# EAGLE schematic Schaltplan (EAGLE 6.5.0)
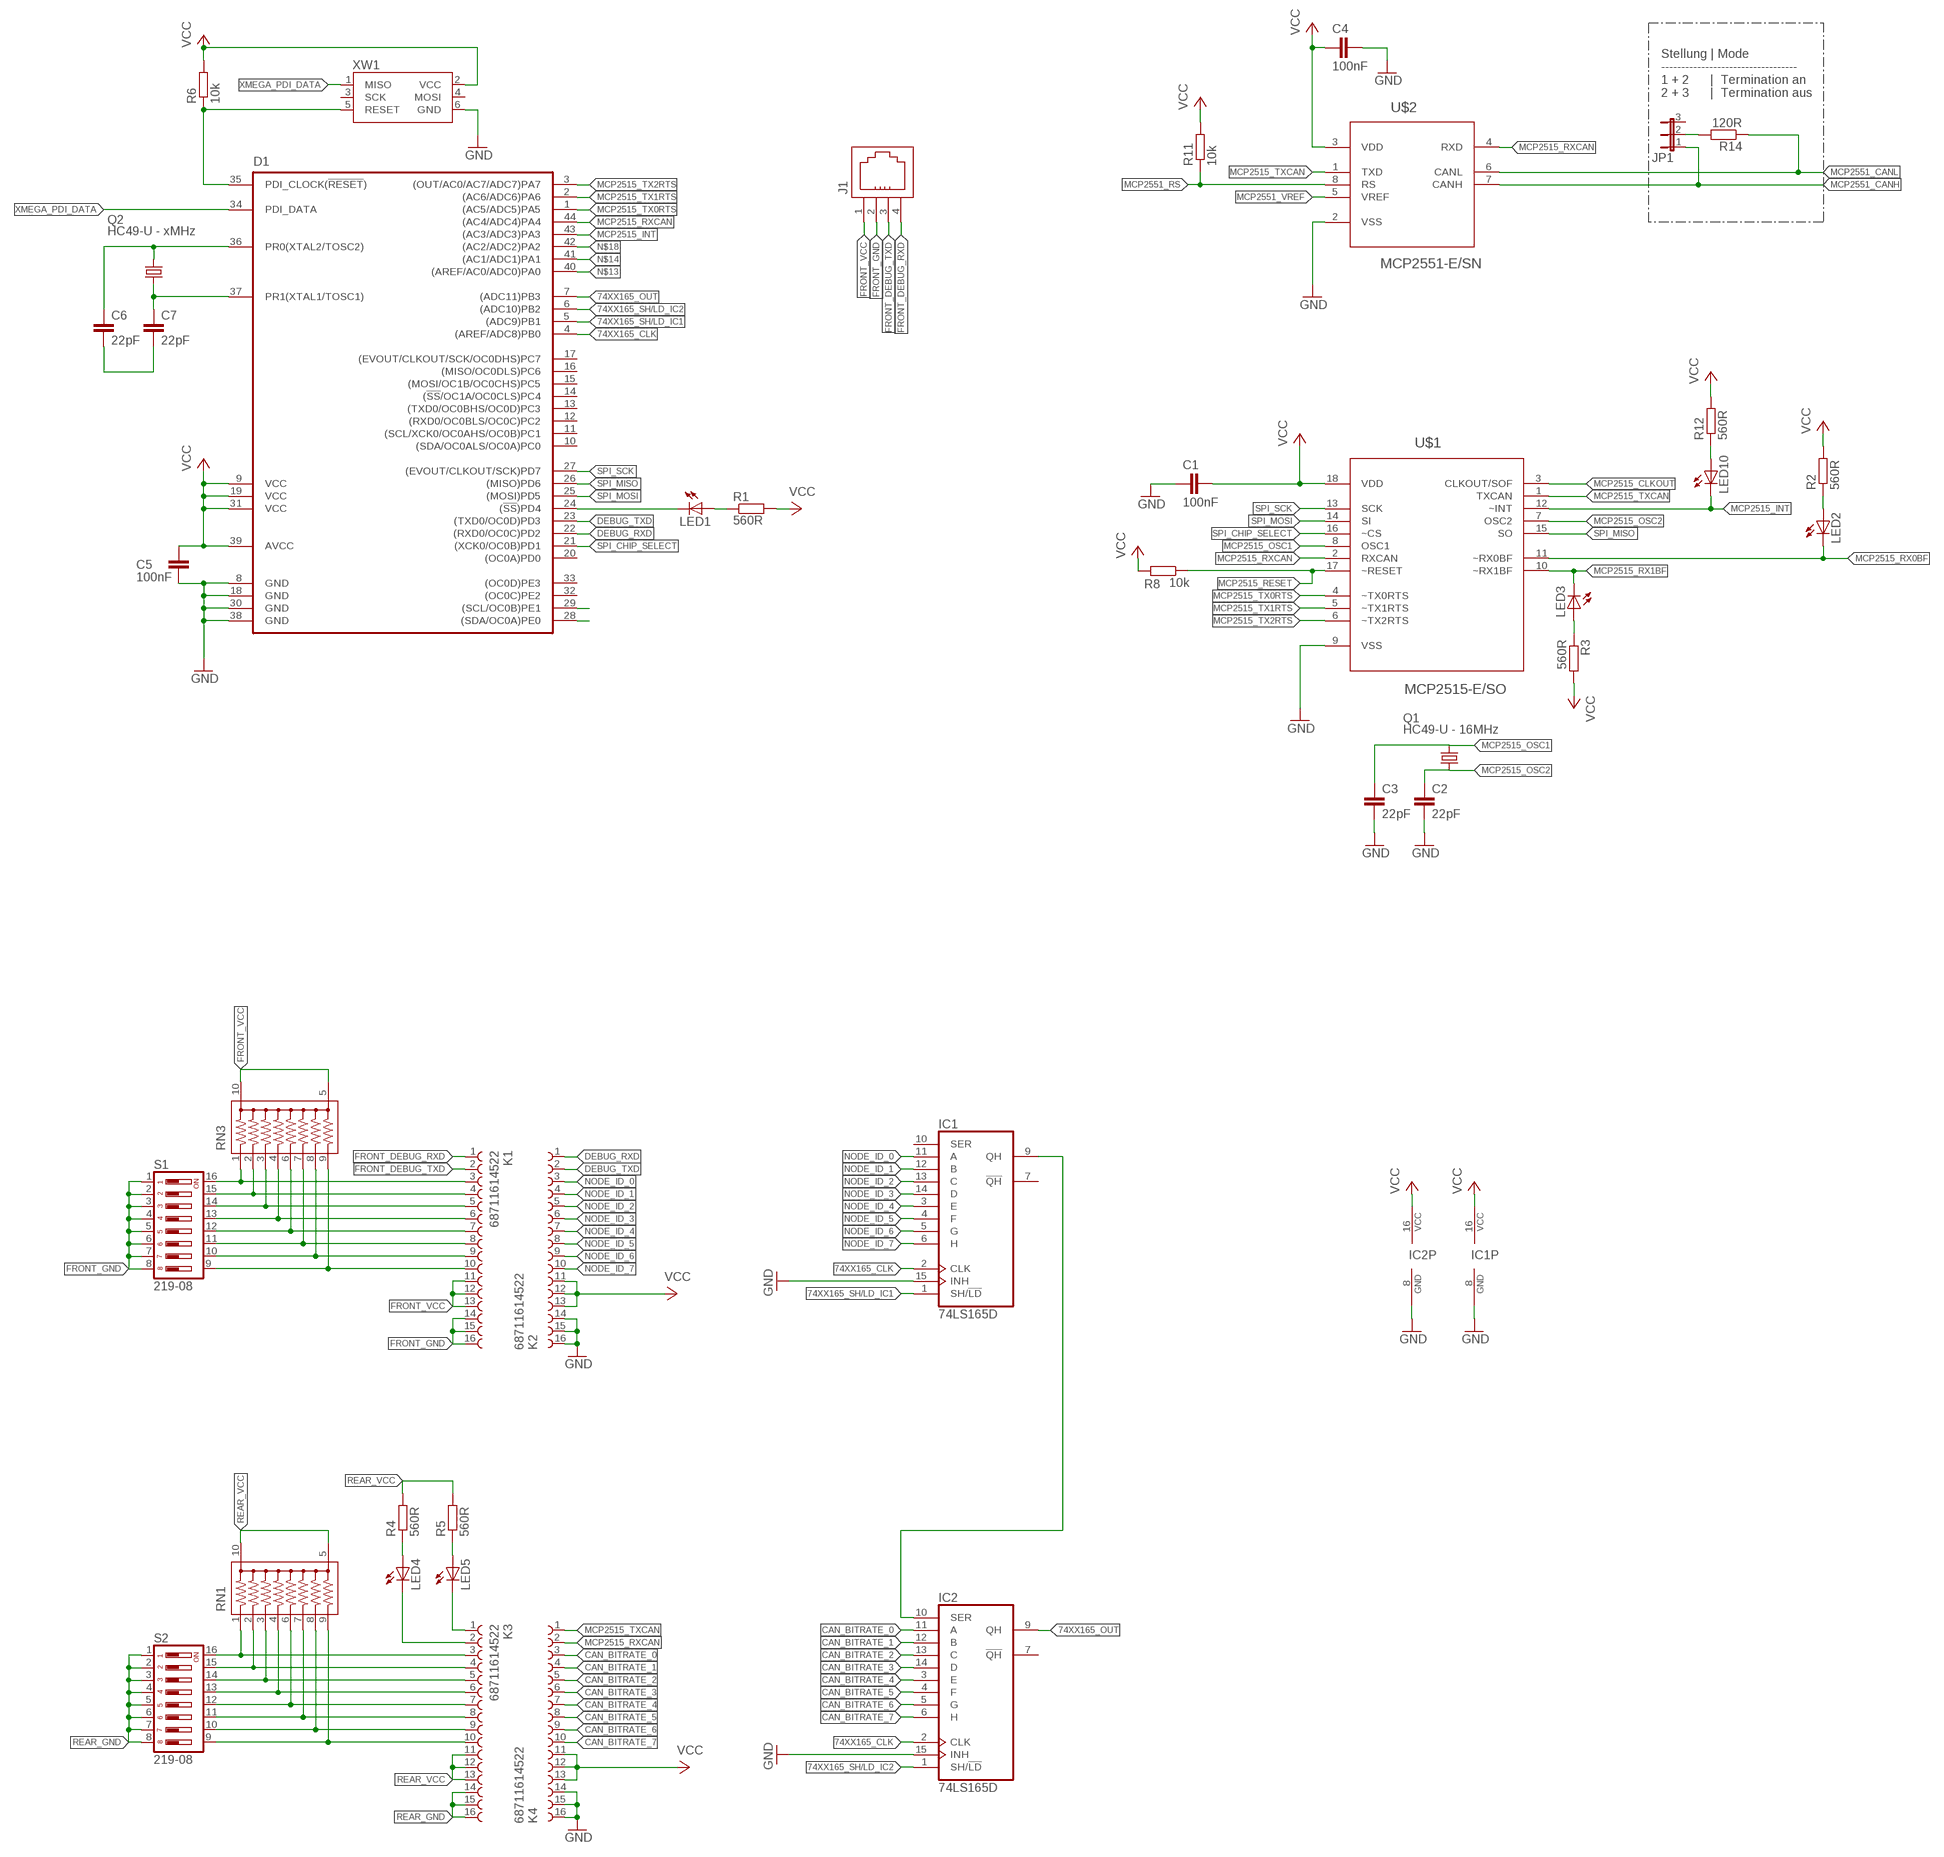
[diagram p0: schematic, sheet 1]

## Parts
C1  100nF  C-EUC1206  [C1206]
C2  22pF  C-EUC1206  [C1206]
C3  22pF  C-EUC1206  [C1206]
C4  100nF  C-EUC1206  [C1206]
C5  100nF  C-EUC1206  [C1206]
C6  22pF  C-EUC1206  [C1206]
C7  22pF  C-EUC1206  [C1206]
D1  ATXMEGA16D4/32D4/64D4/128D4-A  [TQFP44A]
IC1  74LS165D  [SO16]
IC2  74LS165D  [SO16]
J1  615004143821  [615004143821]
JP1  JP2E  [JP2]
K1  68711614522  [68711614522]
K2  68711614522  [68711614522]
K3  68711614522  [68711614522]
K4  68711614522  [68711614522]
LED1  LEDSML1206  [SML1206]
LED2  LEDSML1206  [SML1206]
LED3  LEDSML1206  [SML1206]
LED4  LEDSML1206  [SML1206]
LED5  LEDSML1206  [SML1206]
LED10  LEDSML1206  [SML1206]
Q1  HC49-U - 16MHz  HC49-U  [HC49]
Q2  HC49-U - xMHz  HC49-U  [HC49]
R1  560R  R-EU_R1206  [R1206]
R2  560R  R-EU_R1206  [R1206]
R3  560R  R-EU_R1206  [R1206]
R4  560R  R-EU_R1206  [R1206]
R5  560R  R-EU_R1206  [R1206]
R6  10k  R-EU_R1206  [R1206]
R8  10k  R-EU_R1206  [R1206]
R11  10k  R-EU_R1206  [R1206]
R12  560R  R-EU_R1206  [R1206]
R14  120R  R-EU_R1206  [R1206]
RN1  745-10  [745-10]
RN3  745-10  [745-10]
S1  219-08  [CTS-219-08]
S2  219-08  [CTS-219-08]
U$1  MCP2515-E/SO  [SOIC127P1030X265-18N]
U$2  MCP2551-E/SN  [SOIC127P600X175-8N]
XW1  WSL6  [WSL]

## Nets
74XX165_CLK: D1.4((AREF/ADC8)PB0) IC1.2(CLK) IC2.2(CLK)
74XX165_OUT: D1.7((ADC11)PB3) IC2.9(QH)
74XX165_SH/LD_IC1: D1.5((ADC9)PB1) IC1.1(SH/!LD)
74XX165_SH/LD_IC2: D1.6((ADC10)PB2) IC2.1(SH/!LD)
CAN_BITRATE_0: IC2.11(A) K4.3
CAN_BITRATE_1: IC2.12(B) K4.4
CAN_BITRATE_2: IC2.13(C) K4.5
CAN_BITRATE_3: IC2.14(D) K4.6
CAN_BITRATE_4: IC2.3(E) K4.7
CAN_BITRATE_5: IC2.4(F) K4.8
CAN_BITRATE_6: IC2.5(G) K4.9
CAN_BITRATE_7: IC2.6(H) K4.10
DEBUG_RXD: D1.22((RXD0/OC0C)PD2) K2.1
DEBUG_TXD: D1.23((TXD0/OC0D)PD3) K2.2
FRONT_DEBUG_RXD: J1.4 K1.1
FRONT_DEBUG_TXD: J1.3 K1.2
FRONT_GND: J1.2 K1.14 K1.15 K1.16 S1.1 S1.2 S1.3 S1.4 S1.5 S1.6 S1.7 S1.8
FRONT_VCC: J1.1 K1.11 K1.12 K1.13 RN3.5 RN3.10
GND: C1.2 C2.2 C3.2 C4.1 C5.2 D1.8(GND) D1.18(GND) D1.30(GND) D1.38(GND) IC1.8(GND) IC1.15(INH) IC2.8(GND) IC2.15(INH) K2.14 K2.15 K2.16 K4.14 K4.15 K4.16 U$1.9(VSS) U$2.2(VSS) XW1.6(GND)
MCP2515_CLKOUT: U$1.3(CLKOUT/SOF)
MCP2515_INT: D1.43((AC3/ADC3)PA3) LED10.C U$1.12(~INT)
MCP2515_OSC1: C3.1 Q1.2 U$1.8(OSC1)
MCP2515_OSC2: C2.1 Q1.1 U$1.7(OSC2)
MCP2515_RESET: R8.1 U$1.17(~RESET)
MCP2515_RX0BF: LED2.C U$1.11(~RX0BF)
MCP2515_RX1BF: LED3.C U$1.10(~RX1BF)
MCP2515_RXCAN: D1.44((AC4/ADC4)PA4) K4.2 U$1.2(RXCAN) U$2.4(RXD)
MCP2515_TX0RTS: D1.1((AC5/ADC5)PA5) U$1.4(~TX0RTS)
MCP2515_TX1RTS: D1.2((AC6/ADC6)PA6) U$1.5(~TX1RTS)
MCP2515_TX2RTS: D1.3((OUT/AC0/AC7/ADC7)PA7) U$1.6(~TX2RTS)
MCP2515_TXCAN: K4.1 U$1.1(TXCAN) U$2.1(TXD)
MCP2551_CANH: JP1.1 U$2.7(CANH)
MCP2551_CANL: R14.1 U$2.6(CANL)
MCP2551_RS: R11.1 U$2.8(RS)
MCP2551_VREF: U$2.5(VREF)
N$1: LED2.A R2.1
N$2: IC1.9(QH) IC2.10(SER)
N$3: LED3.A R3.1
N$4: K3.3 RN1.1 S2.16
N$5: K3.4 RN1.2 S2.15
N$6: K3.5 RN1.3 S2.14
N$7: K3.6 RN1.4 S2.13
N$8: K3.7 RN1.6 S2.12
N$9: K3.8 RN1.7 S2.11
N$11: LED10.A R12.1
N$12: JP1.2 R14.2
N$13: D1.40((AREF/AC0/ADC0)PA0)
N$14: D1.41((AC1/ADC1)PA1)
N$15: C6.1 D1.36(PR0(XTAL2/TOSC2)) Q2.2
N$16: C7.1 D1.37(PR1(XTAL1/TOSC1)) Q2.1
N$17: C6.2 C7.2
N$18: D1.42((AC2/ADC2)PA2)
N$19: K3.9 RN1.8 S2.10
N$20: D1.28((SDA/OC0A)PE0)
N$21: D1.29((SCL/OC0B)PE1)
N$22: K1.3 RN3.1 S1.16
N$23: K1.4 RN3.2 S1.15
N$24: K1.5 RN3.3 S1.14
N$25: K1.6 RN3.4 S1.13
N$26: K1.7 RN3.6 S1.12
N$27: K1.8 RN3.7 S1.11
N$28: K1.9 RN3.8 S1.10
N$29: K1.10 RN3.9 S1.9
N$30: K3.10 RN1.9 S2.9
N$31: D1.35(PDI_CLOCK(!RESET!)) R6.1 XW1.5(RESET)
N$32: LED1.A R1.1
N$33: K3.1 LED5.C
N$34: K3.2 LED4.C
N$35: LED4.A R4.1
N$36: LED5.A R5.1
NODE_ID_0: IC1.11(A) K2.3
NODE_ID_1: IC1.12(B) K2.4
NODE_ID_2: IC1.13(C) K2.5
NODE_ID_3: IC1.14(D) K2.6
NODE_ID_4: IC1.3(E) K2.7
NODE_ID_5: IC1.4(F) K2.8
NODE_ID_6: IC1.5(G) K2.9
NODE_ID_7: IC1.6(H) K2.10
REAR_GND: K3.14 K3.15 K3.16 S2.1 S2.2 S2.3 S2.4 S2.5 S2.6 S2.7 S2.8
REAR_VCC: K3.11 K3.12 K3.13 R4.2 R5.2 RN1.5 RN1.10
SPI_CHIP_SELECT: D1.21((XCK0/OC0B)PD1) U$1.16(~CS)
SPI_MISO: D1.26((MISO)PD6) U$1.15(SO)
SPI_MOSI: D1.25((MOSI)PD5) U$1.14(SI)
SPI_SCK: D1.27((EVOUT/CLKOUT/SCK)PD7) U$1.13(SCK)
SPI_SLAVE_SELECT_HW: D1.24((!SS!)PD4) LED1.C
VCC: C1.1 C4.2 C5.1 D1.9(VCC) D1.19(VCC) D1.31(VCC) D1.39(AVCC) IC1.16(VCC) IC2.16(VCC) K2.11 K2.12 K2.13 K4.11 K4.12 K4.13 R1.2 R2.2 R3.2 R6.2 R8.2 R11.2 R12.2 U$1.18(VDD) U$2.3(VDD) XW1.2(VCC)
XMEGA_PDI_DATA: D1.34(PDI_DATA) XW1.1(MISO)
Unconnected: D1.10((SDA/OC0ALS/OC0A)PC0) D1.11((SCL/XCK0/OC0AHS/OC0B)PC1) D1.12((RXD0/OC0BLS/OC0C)PC2) D1.13((TXD0/OC0BHS/OC0D)PC3) D1.14((!SS!/OC1A/OC0CLS)PC4) D1.15((MOSI/OC1B/OC0CHS)PC5) D1.16((MISO/OC0DLS)PC6) D1.17((EVOUT/CLKOUT/SCK/OC0DHS)PC7) D1.20((OC0A)PD0) D1.32((OC0C)PE2) D1.33((OC0D)PE3) IC1.7(!QH) IC1.10(SER) IC2.7(!QH) JP1.3 XW1.3(SCK) XW1.4(MOSI)

## Notes on the sheet
- Stellung | Mode
  ----------------------------------
  1 + 2      |  Termination an
  2 + 3      |  Termination aus

## Library data of the parts
C1-C7 = rcl:C-EU: CAPACITOR, European symbol
D1 = AVR - XMEGA:ATXMEGA16D4/32D4/64D4/128D4-: Name des Bauteiles: -->ATxmega32D4-AU Daten:SMD-Microcontroller 8/16 Bit Artikelnummer:#045426 Datenblatt:Siehe Hesch Suche ! __________________________________________ generated by Eagle Description Tool am : 14.02.2017 11:35:40 erstellt von: Hm
IC1 IC2 = 74xx-us:74*165: 8-bit parallel load SHIFT REGISTER
J1 = InputOutputIO (rev18b):615004143821: WR-MJ Horizontal Plastic 4P4C Modular Jack Tab Up, 4 Pins=>Code : Con_I-O_MJ-H_Plastic_Up_615004143821 <http://katalog.we-online.de/media/images/eican/Con_I-O_MJ-H_Plastic_Up_615004143821_pf2.jpg> Details see: http://katalog.we-online.de/en/em/MJ_HORIZONTAL_PLASTIC_4P4C_TAB_UP Created 2014-07-10, Karrer Zheng 2014 (C) Würth Elektronik
JP1 = jumper:JP2E: JUMPER
K1-K4 = Wurth_FPC_FFC:68711614522: WE-FPC 0.5mm SMT ZIF Horizontal Bottom Contact, 16 Pins=>Code : Con_FPC_ZIF_0.50_68711614522 <http://katalog.we-online.de/media/images/eican/Con_FPC_ZIF_0.50_6871xx14522_pf2.jpg> Details see: http://katalog.we-online.de/en/em/687_1xx_145_22 Created 2014-07-09, Karrer Zheng 2014 (C) Würth Elektronik
LED1-LED5 LED10 = led:LED: LED OSRAM: - CHIPLED LG R971, LG N971, LY N971, LG Q971, LY Q971, LO R971, LY R971 LH N974, LH R974 LS Q976, LO Q976, LY Q976 LO Q996 - Hyper CHIPLED LW Q18S LB Q993, LB Q99A, LB R99A - SideLED LS A670, LO A670, LY A670, LG A670, LP A670 LB A673, LV A673, LT A673, LW A673 LH A674 LY A675 LS A676, LA A676, LO A676, LY A676, LW A676 LS A679, LY A679, LG A679 - Hyper Micro SIDELED® LS Y876, LA Y876, LO Y876, LY Y876 LT Y87S - SmartLED LW L88C, LW L88S LB L89C, LB L89S, LG L890 LS L89K, LO L89K, LY L89K LS L896, LA L896, LO L896, LY L896 - TOPLED LS T670, LO T670, LY T670, LG T670, LP T670 LSG T670, LSP T670, LSY T670, LOP T670, LYG T670 LG T671, LOG T671, LSG T671 LB T673, LV T673, LT T673, LW T673 LH T674 LS T676, LA T676, LO T676, LY T676, LB T676, LH T676, LSB T676, LW T676 LB T67C, LV T67C, LT T67C, LS T67K, LO T67K, LY T67K, LW E67C LS E67B, LA E67B, LO E67B, LY E67B, LB E67C, LV E67C, LT E67C LW T67C LS T679, LY T679, LG T679 LS T770, LO T770, LY T770, LG T770, LP T770 LB T773, LV T773, LT T773, LW T773 LH T774 LS E675, LA E675, LY E675, LS T675 LS T776, LA T776, LO T776, LY T776, LB T776 LHGB T686 LT T68C, LB T68C - Hyper Mini TOPLED® LB M676 - Mini TOPLED Santana® LG M470 LS M47K, LO M47K, LY M47K Source: http://www.osram.convergy.de LUXEON: - LUMILED® LXK2-PW12-R00, LXK2-PW12-S00, LXK2-PW14-U00, LXK2-PW14-V00 LXK2-PM12-R00, LXK2-PM12-S00, LXK2-PM14-U00 LXK2-PE12-Q00, LXK2-PE12-R00, LXK2-PE12-S00, LXK2-PE14-T00, LXK2-PE14-U00 LXK2-PB12-K00, LXK2-PB12-L00, LXK2-PB12-M00, LXK2-PB14-N00, LXK2-PB14-P00, LXK2-PB14-Q00 LXK2-PR12-L00, LXK2-PR12-M00, LXK2-PR14-Q00, LXK2-PR14-R00 LXK2-PD12-Q00, LXK2-PD12-R00, LXK2-PD12-S00 LXK2-PH12-R00, LXK2-PH12-S00 LXK2-PL12-P00, LXK2-PL12-Q00, LXK2-PL12-R00 Source: www.luxeon.com KINGBRIGHT: KA-3528ASYC Source: www.kingbright.com
Q1 Q2 = Quarz - HC49UP:HC49: Name des Bauteiles: -->HC49U/P Daten:16 MHz (16000000 Hz) Artikelnummer:#023006 Datenblatt:www.alldatasheet.com __________________________________________ generated by Eagle Description Tool am : 22.01.2014 13:23:52 erstellt von: Hm
R1-R6 R8 R11 R12 R14 = rcl:R-EU_: RESISTOR, European symbol
RN1 RN3 = resistor-array:745-10: CTS 745 Series 8 Resistors, 10 Terminations
S1 S2 = switch-dil:219-08*: Surface Mount DIP Switch Series 219 SMT CTS Electronic Components Sourc: www.ctscorp.com; OC_FARNELL: unknown; OC_NEWARK: unknown
U$1 = Microchip_By_element14_Batch_1:MCP2515-E/SO: Stand-Alone CAN Controller; DESCRIPTION: IC CAN CONTROLLER; MPN: MCP2515-E/SO; OC_FARNELL: 1605565; OC_NEWARK: 29H7134; PACKAGE: SOIC-18; SUPPLIER: Microchip
U$2 = Microchip_By_element14_Batch_1:MCP2551-E/SN: High-Speed CAN Transceiver; DESCRIPTION: High-Speed CAN Transceiver; MPN: MCP2551-E/SN; OC_FARNELL: 1467746; OC_NEWARK: 92C4186; PACKAGE: SOIC-8; SUPPLIER: Microchip
XW1 = Atmel - ISP_6   (AVR ISP MKII):WSL: Name des Bauteiles: Wannenstecker 6 pol. Daten: 6 pol. goldene Kontakte ! Artikelnummer:#131231 Datenblatt:www.datasheet.com / www.reichelt.de